# Altium project IcanStudioLive Controller mini fix.PrjPcb
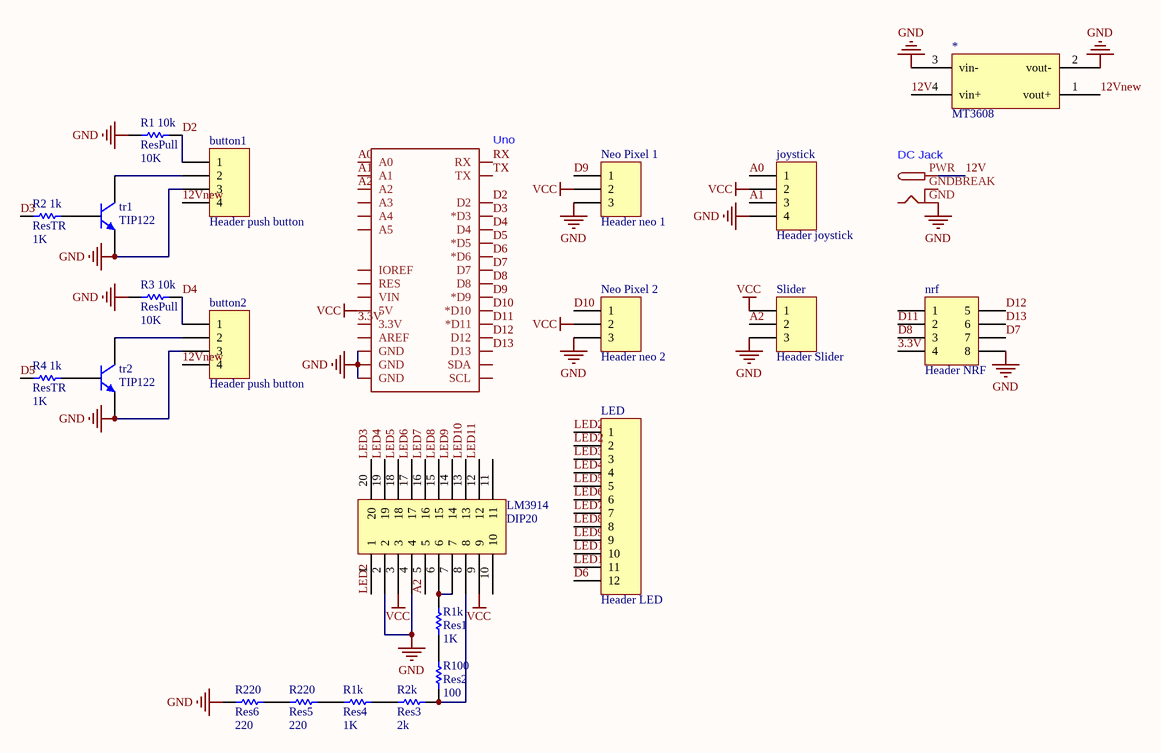
[diagram p0: IcanStudioLive Controller mini fix.SchDoc]
1 sheet, 24 parts. Net scope: global (net labels, ports and power ports of the same name join across sheets).
Board file: IcanStudioLive Controller mini fix.PcbDoc

## Sheet IcanStudioLive Controller mini fix.SchDoc
size A4

### Parts
(Parts that share a designator on the sheet are numbered #1, #2 ... from top to bottom, then left to right.)
*  MT3608  [PCBComponent_1]
button1  Header push button  [HDR1X4]
button2  Header push button  [HDR1X4]
DC_Jack  (no value)  [DC Jack]
joystick  Header joystick  [HDR1X4]
LED  Header LED  [HDR1X12]
LM3914  DIP20  [DIP20]
Neo_Pixel_1  Header neo 1  [HDR1X3]
Neo_Pixel_2  Header neo 2  [HDR1X3]
nrf  Header NRF  [HDR2X4_CEN]
R1_10k  ResPull  value 10K  [AXIAL-0.3]
R1k#1  Res1  value 1K  [AXIAL-0.3]
R1k#2  Res4  value 1K  [AXIAL-0.3]
R2_1k  ResTR  value 1K  [AXIAL-0.3]
R2k  Res3  value 2k  [AXIAL-0.3]
R3_10k  ResPull  value 10K  [AXIAL-0.3]
R4_1k  ResTR  value 1K  [AXIAL-0.3]
R100  Res2  value 100  [AXIAL-0.3]
R220#1  Res5  value 220  [AXIAL-0.3]
R220#2  Res6  value 220  [AXIAL-0.3]
Slider  Header Slider  [HDR1X3]
tr1  TIP122  [tip122]
tr2  TIP122  [tip122]
Uno  (no value)  [Arduino Uno R3]

### Nets
GND: *.2(vout-) *.3(vin-) button1.3 button2.3 DC_Jack.GND joystick.4 LM3914.2 LM3914.4 Neo_Pixel_1.3 Neo_Pixel_2.3 nrf.8 R1_10k.1 R3_10k.1 R220#2.2 Slider.3 tr1.3(E) tr2.3(E) Uno.GND@0(GND) Uno.GND@1(GND) Uno.GND@2(GND)
VCC: joystick.2 LM3914.3 LM3914.9 Neo_Pixel_1.2 Neo_Pixel_2.2 Slider.1 Uno.5V
3.3V: nrf.4 Uno.3.3V
12V: *.4(vin+) DC_Jack.PWR
12Vnew: *.1(vout+) button1.4 button2.4
A0: joystick.1 Uno.A0
A1: joystick.3 Uno.A1
A2: LM3914.5 Slider.2 Uno.A2
D2: button1.1 R1_10k.2 Uno.D2
D3: R2_1k.1 Uno.D3(*D3)
D4: button2.1 R3_10k.2 Uno.D4
D5: R4_1k.1 Uno.D5(*D5)
D6: LED.12 Uno.D6(*D6)
D7: nrf.7 Uno.D7
D8: nrf.3 Uno.D8
D9: Neo_Pixel_1.1 Uno.D9(*D9)
D10: Neo_Pixel_2.1 Uno.D10(*D10)
D11: nrf.2 Uno.D11(*D11)
D12: nrf.5 Uno.D12
D13: nrf.6 Uno.D13
LED2: LED.1 LED.2 LM3914.1
LED3: LED.3 LM3914.20
LED4: LED.4 LM3914.19
LED5: LED.5 LM3914.18
LED6: LED.6 LM3914.17
LED7: LED.7 LM3914.16
LED8: LED.8 LM3914.15
LED9: LED.9 LM3914.14
LED10: LED.10 LM3914.13
LED11: LED.11 LM3914.12
RX: Uno.RX
TX: Uno.TX
Netbutton1_2: button1.2 tr1.2(C)
Netbutton2_2: button2.2 tr2.2(C)
NetLM3914_6: LM3914.6 LM3914.7 R1k#1.2
NetLM3914_8: LM3914.8 R2k.2 R100.1
NetR1k#1_1: R1k#1.1 R100.2
NetR1k#2_1: R1k#2.1 R220#1.2
NetR1k#2_2: R1k#2.2 R2k.1
NetR2_1k_2: R2_1k.2 tr1.1(B)
NetR4_1k_2: R4_1k.2 tr2.1(B)
NetR220#1_1: R220#1.1 R220#2.1

Not connected (* = marked no-connect by the designer): DC_Jack GNDBREAK; LM3914 10 11; nrf 1; Uno A3 A4 A5 AREF IOREF RES SCL SDA VIN

### Library data of the parts
* = Component_1
button1 button2 joystick = Header 4: Header, 4-Pin; LatestRevisionDate: 17-Jul-2002; LatestRevisionNote: Re-released for DXP Platform.; Publisher: Altium Limited
DC_Jack = DCBARREL
LED = Header 12: Header, 12-Pin; LatestRevisionDate: 17-Jul-2002; LatestRevisionNote: Re-released for DXP Platform.; Publisher: Altium Limited
Neo_Pixel_1 Neo_Pixel_2 Slider = Header 3: Header, 3-Pin; LatestRevisionDate: 17-Jul-2002; LatestRevisionNote: Re-released for DXP Platform.; Publisher: Altium Limited
nrf = Header 4X2A: Header, 4-Pin, Dual row; LatestRevisionDate: 17-Jul-2002; LatestRevisionNote: Re-released for DXP Platform.; Publisher: Altium Limited
R1_10k R1k#1 R1k#2 R2_1k R2k R3_10k R4_1k R100 R220#1 R220#2 = Res1: Resistor; Published: 8-Jun-2000; LatestRevisionDate: 17-Jul-2002; LatestRevisionNote: Re-released for DXP Platform.; PackageReference: AXIAL-0.3; Publisher: Altium Limited; PackageDescription: Axial Device, Thru-Hole; 2 Leads; 0.3 in Pin Spacing
tr1 tr2 = 2N3904: NPN General Purpose Amplifier; Published: 8-Jun-2000; LatestRevisionDate: 15-Jan-2003; LatestRevisionNote: PCB Footprint 'BCY-W3/D4.7' replaced; DatasheetVersion: 1997; PackageVersion: Sep-1998; PackageReference: TO-92A; Publisher: Altium Limited; PackageDescription: TO, Flat Index; 3 In-Line, Axial Leads; Body Dia. 4.5mm; Leads 0.51 x 0.48 mm (max); ComponentLink1Description: Manufacturer Link; ComponentLink1URL: http://www.fairchildsemi.com/; ComponentLink2Description: Datasheet; ComponentLink2URL: http://www.fairchildsemi.com/ds/2N%2F2N3904.pdf
Uno = ARDUINO_R3_SHIELD